# EAGLE design Pi-ic880a (EAGLE 8.4.0)
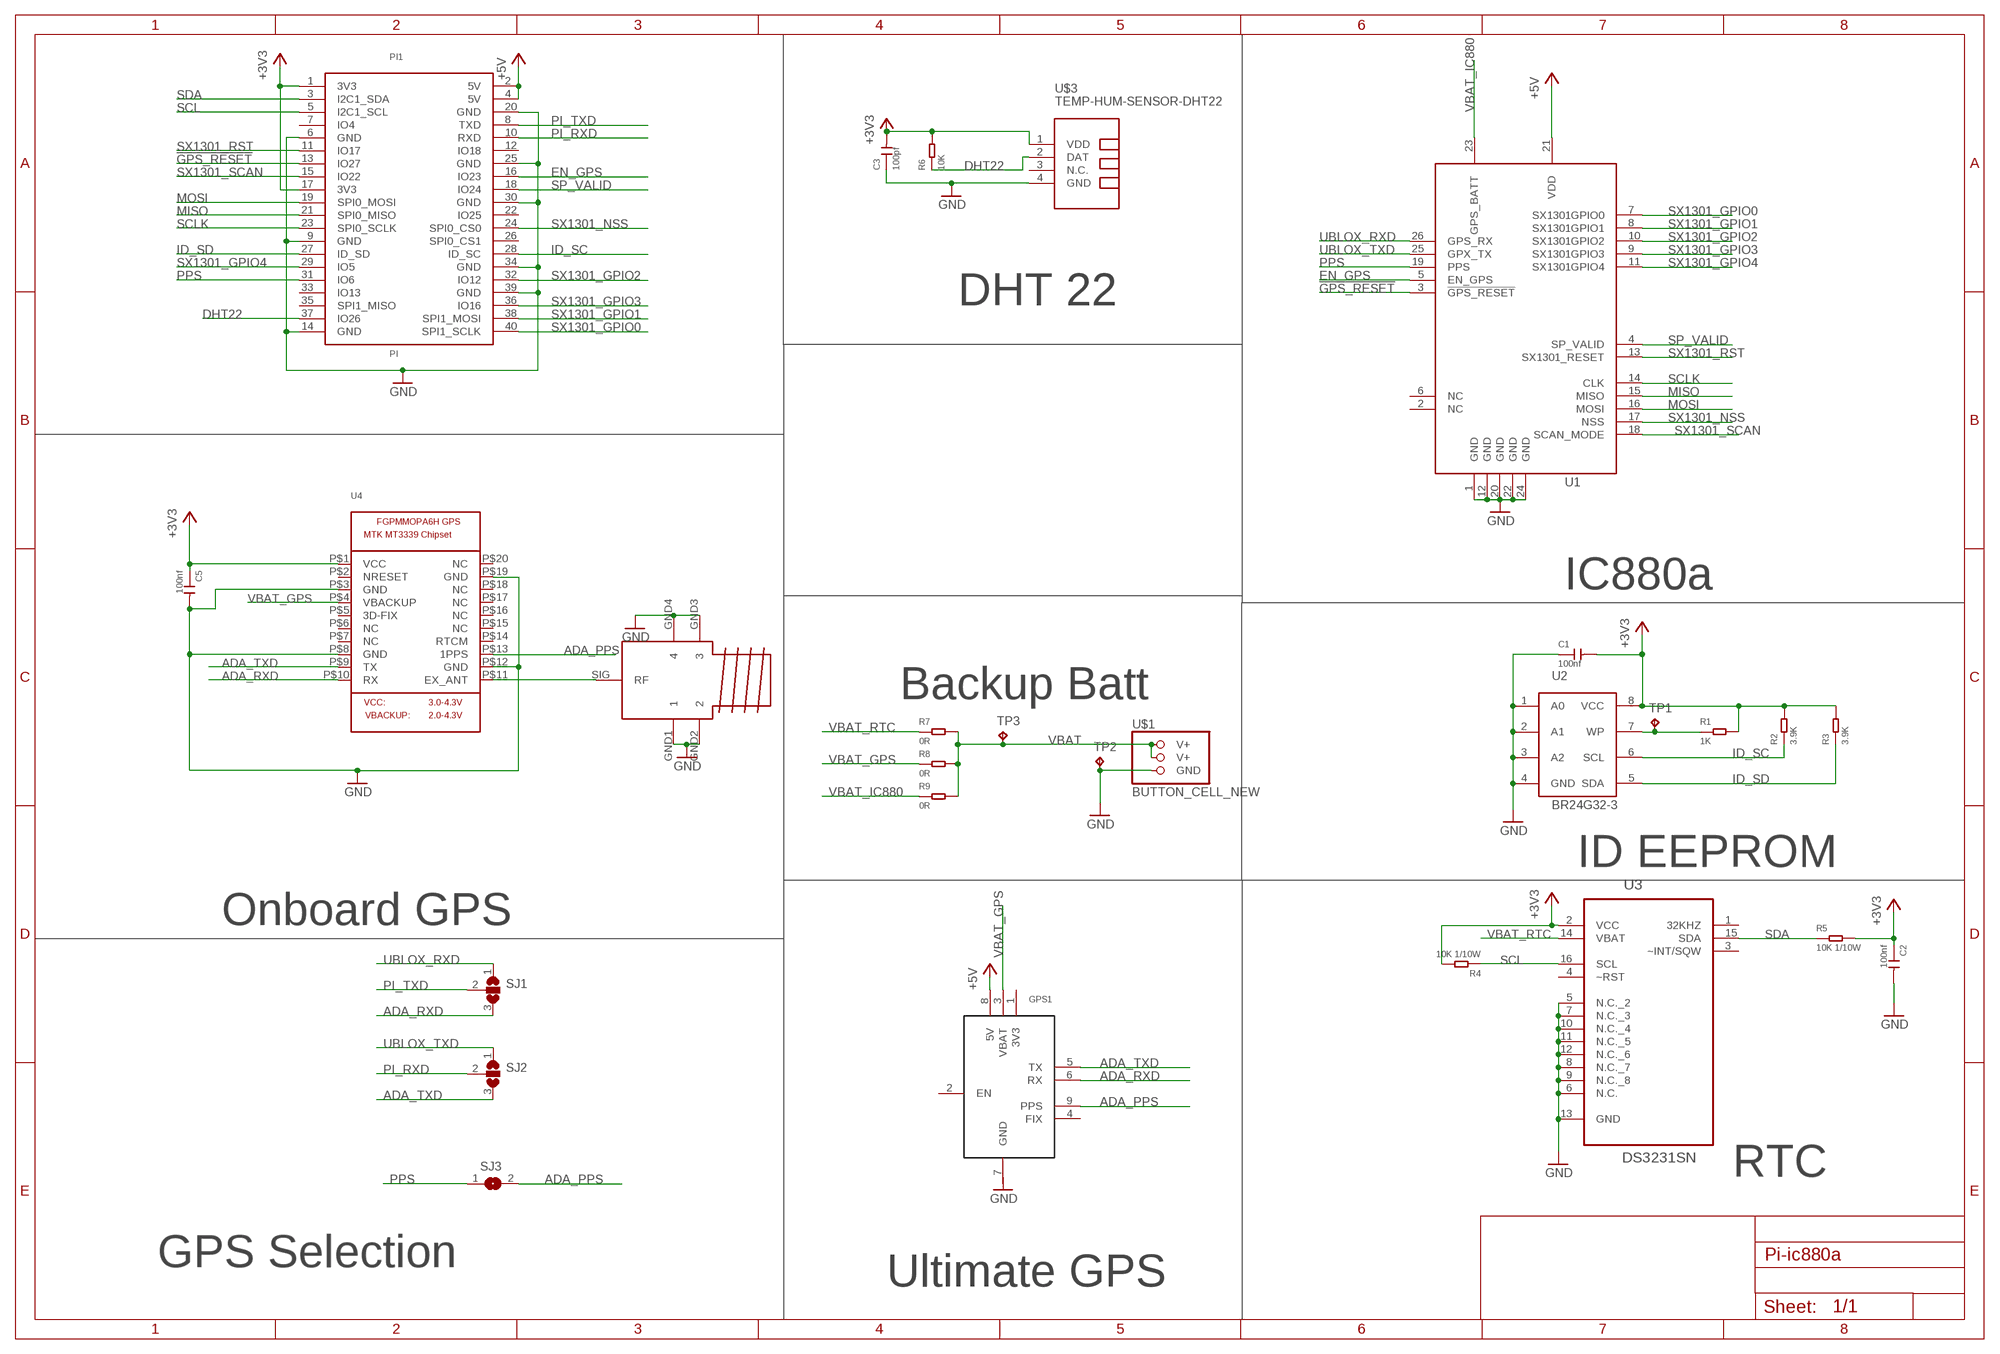
[diagram p0: schematic, sheet 1]

## Parts
C1  100nf  CERAMIC-100NF-50V-10%-X7R(0603)  [C0603]
C2  100nf  CERAMIC-100NF-50V-10%-X7R(0603)  [C0603]
C3  100pf  CERAMIC-100PF-50V-5%-NPO(0603)  [C0603]
C5  100nf  CERAMIC-100NF-50V-10%-X7R(0603)  [C0603]
GPS1  ULTIMATE-GPS  [ULTIMATE-GPS]
PI1  PI  [PI]
R1  1K  SMD-RES-1K-1%-1/10W(0603)  [R0603]
R2  3.9K  SMD-RES-3.9K-5%-1/10W(0603)  [R0603]
R3  3.9K  SMD-RES-3.9K-5%-1/10W(0603)  [R0603]
R4  10K 1/10W  SMD-RES-10K-5%-1/10W(0603)  [R0603]
R5  10K 1/10W  SMD-RES-10K-5%-1/10W(0603)  [R0603]
R6  10K  SMD-RES-10K-1%-1/10W(0603)  [R0603]
R7  0R  SMD-RES-0R-5%-1/10W(0603)  [R0603]
R8  0R  SMD-RES-0R-5%-1/10W(0603)  [R0603]
R9  0R  SMD-RES-0R-5%-1/10W(0603)  [R0603]
SJ1  SJ2W  [SJ_2]
SJ2  SJ2W  [SJ_2]
SJ3  SJ  [SJ]
TP1  TPB2,54  [B2,54]
TP2  TPB2,54  [B2,54]
TP3  TPB2,54  [B2,54]
U1  IC880A  [IC880A]
U2  BR24G32-3  [SOP8]
U3  DS3231SN  [SOIC127P1032X265-16N]
U4  GPS_FGPMMOPA6H  [FGPMMOPA6H]
U$1  BUTTON_CELL_NEW  [CR2016]
U$2  SMATH  [SMA]
U$3  TEMP-HUM-SENSOR-DHT22  [TEMP-HUM-SENSOR-DHT22]

## Nets
!GPS_RESET: PI1.13(IO27) U1.3(!GPS_RESET)
+3V3: C1.2 C2.1 C3.2 C5.1 PI1.1(3V3) PI1.17(3V3) R1.2 R2.2 R3.2 R4.2 R5.2 R6.2 U2.8(VCC) U3.2(VCC) U4.P$1(VCC) U$3.1(VDD)
+5V: GPS1.8(5V) PI1.2(5V) PI1.4(5V) U1.21(VDD)
ADA_PPS: GPS1.9(PPS) SJ3.2 U4.P$13(1PPS)
ADA_RXD: GPS1.6(RX) SJ1.3 U4.P$10(RX)
ADA_TXD: GPS1.5(TX) SJ2.3 U4.P$9(TX)
DHT22: PI1.37(IO26) R6.1 U$3.2(DAT)
EN_GPS: PI1.16(IO23) U1.5(EN_GPS)
GND: C1.1 C2.2 C3.1 C5.2 PI1.6(GND) PI1.9(GND) PI1.14(GND) PI1.20(GND) PI1.25(GND) PI1.30(GND) PI1.34(GND) PI1.39(GND) TP2.TP U1.1(GND) U1.12(GND) U1.20(GND) U1.22(GND) U1.24(GND) U2.1(A0) U2.2(A1) U2.3(A2) U2.4(GND) U3.5(N.C._2) U3.6(N.C.) U3.7(N.C._3) U3.8(N.C._7) U3.9(N.C._8) U3.10(N.C._4) U3.11(N.C._5) U3.12(N.C._6) U3.13(GND) U4.P$3(GND) U4.P$8(GND) U4.P$12(GND) U4.P$19(GND) U$1.GND U$2.GND1 U$2.GND2 U$2.GND3 U$2.GND4 U$3.4(GND)
GPS_ANT: U4.P$11(EX_ANT) U$2.SIG(RF)
ID_SC: PI1.28(ID_SC) R2.1 U2.6(SCL)
ID_SD: PI1.27(ID_SD) R3.1 U2.5(SDA)
MISO: PI1.21(SPI0_MISO) U1.15(MISO)
MOSI: PI1.19(SPI0_MOSI) U1.16(MOSI)
PI_RXD: PI1.10(RXD) SJ2.2
PI_TXD: PI1.8(TXD) SJ1.2
PPS: PI1.31(IO6) SJ3.1 U1.19(PPS)
SCL: PI1.5(I2C1_SCL) R4.1 U3.16(SCL)
SCLK: PI1.23(SPI0_SCLK) U1.14(CLK)
SDA: PI1.3(I2C1_SDA) R5.1 U3.15(SDA)
SP_VALID: PI1.18(IO24) U1.4(SP_VALID)
SX1301_GPIO0: PI1.40(SPI1_SCLK) U1.7(SX1301GPIO0)
SX1301_GPIO1: PI1.38(SPI1_MOSI) U1.8(SX1301GPIO1)
SX1301_GPIO2: PI1.32(IO12) U1.10(SX1301GPIO2)
SX1301_GPIO3: PI1.36(IO16) U1.9(SX1301GPIO3)
SX1301_GPIO4: PI1.29(IO5) U1.11(SX1301GPIO4)
SX1301_NSS: PI1.24(SPI0_CS0) U1.17(NSS)
SX1301_RST: PI1.11(IO17) U1.13(SX1301_RESET)
SX1301_SCAN: PI1.15(IO22) U1.18(SCAN_MODE)
UBLOX_RXD: SJ1.1 U1.26(GPS_RX)
UBLOX_TXD: SJ2.1 U1.25(GPX_TX)
VBAT: R7.2 R8.2 R9.2 TP3.TP U$1.V+@1(V+) U$1.V+@2(V+)
VBAT_GPS: GPS1.3(VBAT) R8.1 U4.P$4(VBACKUP)
VBAT_IC880: R9.1 U1.23(GPS_BATT)
VBAT_RTC: R7.1 U3.14(VBAT)
WP: R1.1 TP1.TP U2.7(WP)
Unconnected: GPS1.2(EN) GPS1.4(FIX) PI1.7(IO4) PI1.12(IO18) PI1.22(IO25) PI1.26(SPI0_CS1) PI1.33(IO13) PI1.35(SPI1_MISO) U1.2(NC) U1.6(NC) U3.1(32KHZ) U3.3(~INT/SQW) U3.4(~RST) U4.P$2(NRESET) U4.P$5(3D-FIX) U4.P$6(NC) U4.P$7(NC) U4.P$14(RTCM) U4.P$15(NC) U4.P$16(NC) U4.P$17(NC) U4.P$18(NC) U4.P$20(NC) U$3.3(N.C.)

## Notes on the sheet
- DHT 22
- IC880a
- Backup Batt
- ID EEPROM
- Onboard GPS
- RTC
- GPS Selection
- Ultimate GPS

## Power pins joined to a net without a drawn wire
3V3: GPS1.1(3V3)
GND: GPS1.7(GND)

## Library data of the parts
C1 C2 C5 = Seeed-Capacitor-2016:CERAMIC-100NF-50V-10%-X7R(0603): 302010138; MPN: CC0603KRX7R9BB104
C3 = Seeed-Capacitor:CERAMIC-100PF-50V-5%-NPO(0603): 302010076; MPN: CC0603JRNPO9BN101
GPS1 = fruit-parts:ULTIMATE-GPS
PI1 = fruit-parts:PI
R1 = Seeed-Resistor-2016:SMD-RES-1K-1%-1/10W(0603): 301010298; MPN: RC0603FR-071KL
R2 R3 = Seeed-Resistor-2016:SMD-RES-3.9K-5%-1/10W(0603): 301010101; MPN: RC0603JR-073K9L
R4 R5 = Seeed-Resistor-2016:SMD-RES-10K-5%-1/10W(0603): 301010293; MPN: RC0603JR-0710KL
R6 = Seeed-Resistor:SMD-RES-10K-1%-1/10W(0603): 301010299; MPN: RC0603FR-0710KL
R7-R9 = Seeed-Resistor:SMD-RES-0R-5%-1/10W(0603): 301010292; MPN: RC0603JR-070RL
SJ1 SJ2 = jumper:SJ2W: SMD solder JUMPER
SJ3 = jumper:SJ: SMD solder JUMPER
TP1-TP3 = testpad:TP: Test pad
U1 = fruit-parts:IC880A
U2 = farnell-parts:BR24G32-3: http://uk.farnell.com/rohm/br24g32fj-3gte2/serial-eeprom-32kbit-1mhz-sop/dp/2373743?MER=sy-me-pd-mi-alte
U3 = imported-parts:DS3231SN: Extremely Accurate I2C-Integrated RTC/TCXO/Crystal; MPN: DS3231SN#; OC_FARNELL: 1593292; OC_NEWARK: 68K3406; PACKAGE: SOIC-16; SUPPLIER: Maxim
U4 = fruit-parts:GPS_FGPMMOPA6H: GPS Module - MTK MT3339 Chipset, -165dBm sensitivity, 22 channels, 10Hz, auto-select external antenna options
U$1 = fruit-parts:BUTTON_CELL_NEW
U$2 = fruit-parts:SMA
U$3 = fruit-parts:TEMP-HUM-SENSOR-DHT22: DHT22 - digital humidity & temperature sensor Also known as: AM2302 AM2302 datasheet available here: http://akizukidenshi.com/download/ds/aosong/AM2302.pdf Click here to find device on ebay.com <http://www.ebay.com/sch/dht22+digital+sensor>

## Board
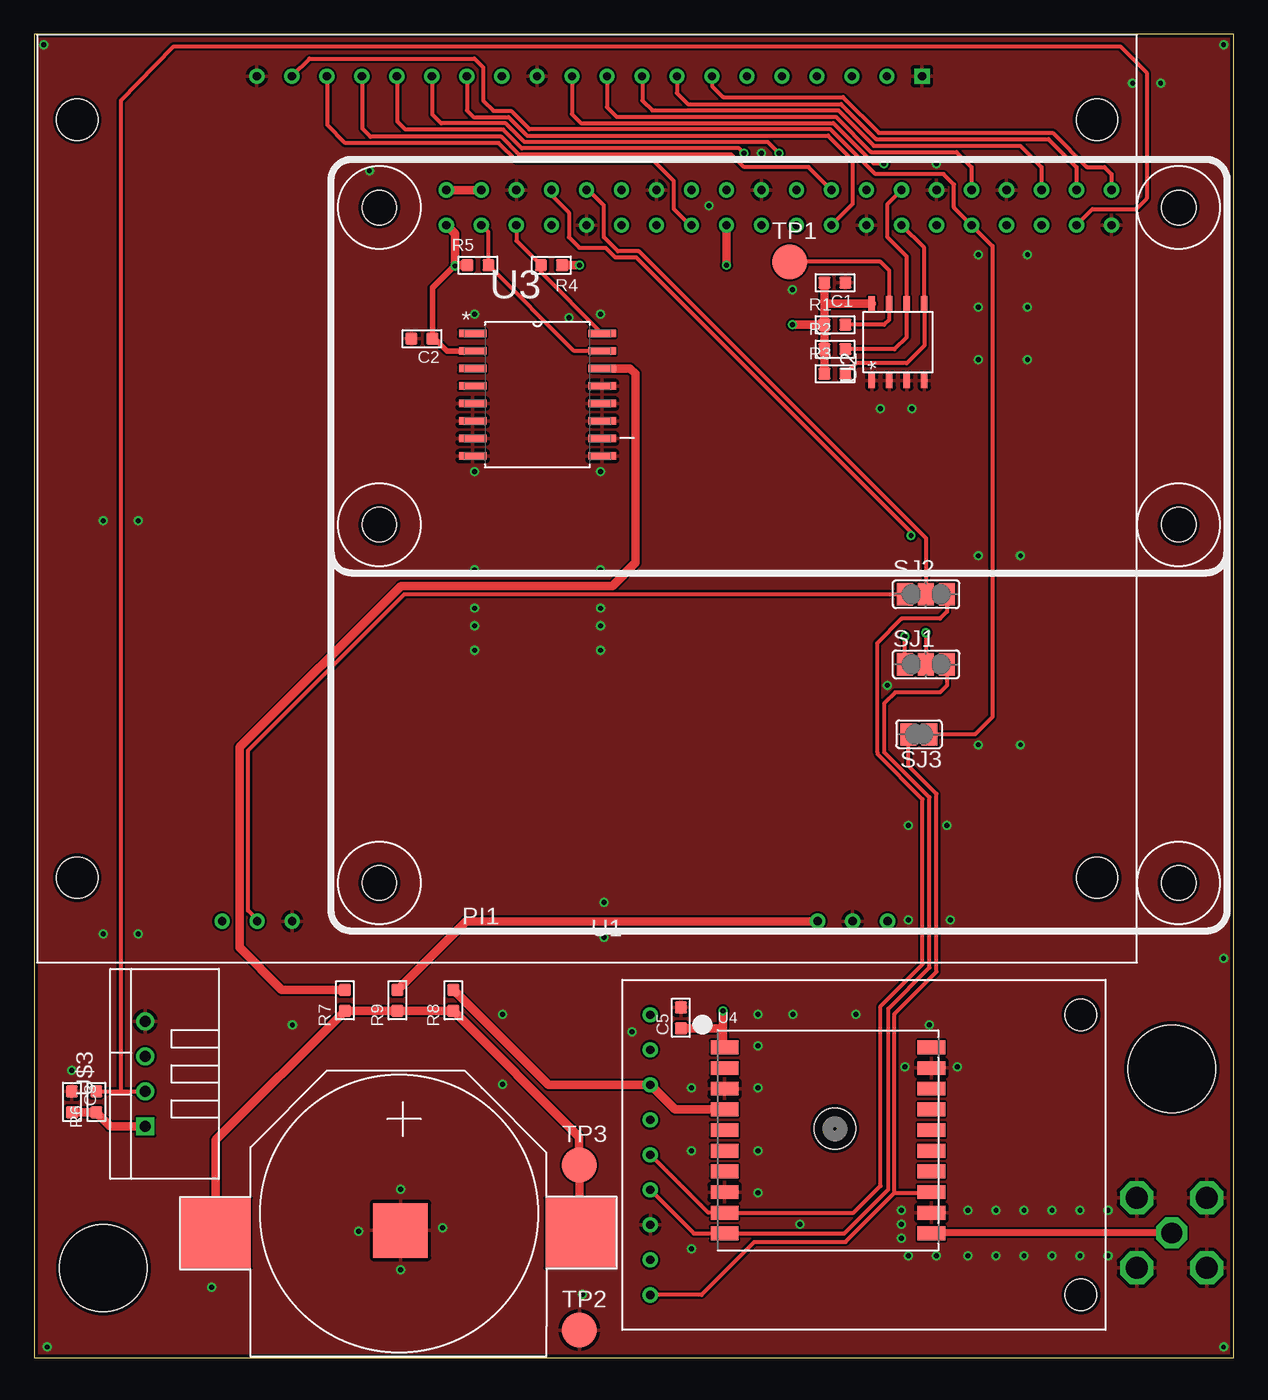
[diagram p1: board, top side]
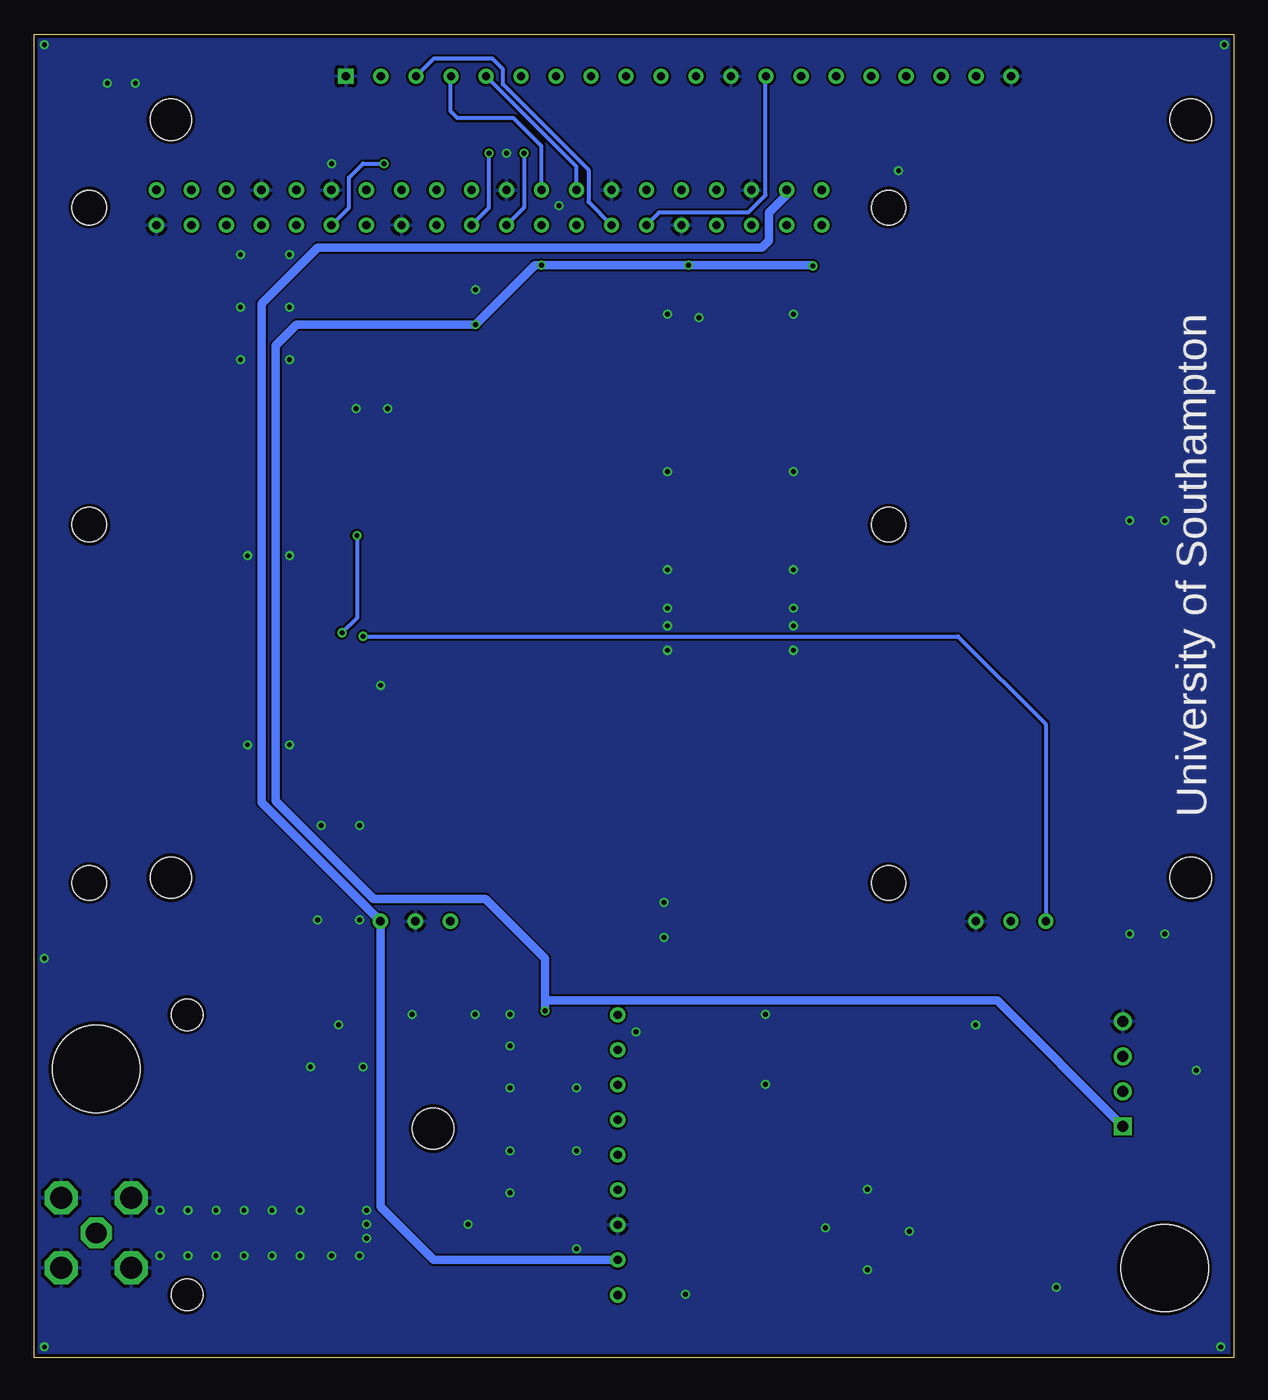
[diagram p2: board, bottom side, seen from below]

Size 87 x 96 mm. Coordinates in mm from the lower left corner, seen from the top.
Outline: 0,0 87,0 87,96 0,96 0,0
Copper layers (1*16): Top 0.035mm / dielectric 1.5mm / Bottom 0.035mm
Design rules "SeeedStudio_2layer_DRU_no_angle_20140221": minimum track width 6mil, minimum drill 12mil, track to track 6mil, track to pad 6mil, pad to pad 6mil, via to via 6mil, smd to smd 0mil, copper to edge 10mil, drill to drill 10mil, minimum pad ring 10mil, minimum via ring 6mil, stop-mask expansion 2mil, vias tented up to drill 100mil, thermal gap 10mil
Holes 6.35 mm at 82.52,20.95 5,6.5

### Footprints (pad centres in the part's own frame; a part is rotated, then mirrored left to right if it is on the bottom)
C0603 = smd 0.889 x 0.889: 1 0,0.762; 2 0,-0.762
ULTIMATE-GPS = drill 0.6: 1 -10.16,-15.494; 2 -7.62,-15.494; 3 -5.08,-15.494; 4 -2.54,-15.494; 5 0,-15.494; 6 2.54,-15.494; 7 5.08,-15.494; 8 7.62,-15.494; 9 10.16,-15.494 | hole 2.286: -10.16,15.748; 10.16,15.748
PI = drill 0.6: 1 -24.13,23.23; 2 -24.13,25.77; 3 -21.59,23.23; 4 -21.59,25.77; 5 -19.05,23.23; 6 -19.05,25.77; 7 -16.51,23.23; 8 -16.51,25.77; 9 -13.97,23.23; 10 -13.97,25.77; 11 -11.43,23.23; 12 -11.43,25.77; 13 -8.89,23.23; 14 -8.89,25.77; 15 -6.35,23.23; 16 -6.35,25.77; 17 -3.81,23.23; 18 -3.81,25.77; 19 -1.27,23.23; 20 -1.27,25.77; 21 1.27,23.23; 22 1.27,25.77; 23 3.81,23.23; 24 3.81,25.77; 25 6.35,23.23; 26 6.35,25.77; 27 8.89,23.23; 28 8.89,25.77; 29 11.43,23.23; 30 11.43,25.77; 31 13.97,23.23; 32 13.97,25.77; 33 16.51,23.23; 34 16.51,25.77; 35 19.05,23.23; 36 19.05,25.77; 37 21.59,23.23; 38 21.59,25.77; 39 24.13,23.23; 40 24.13,25.77 | hole 2.5: -29,24.5; 29,24.5; -29,1.5; 29,1.5; -29,-24.5; 29,-24.5
R0603 = smd 0.889 x 0.889: 1 0,0.762; 2 0,-0.762
SJ_2 = smd 1.168 x 1.6: 1 -1.524,0; 2 0,0; 3 1.524,0
SJ = smd 1.168 x 1.6: 1 -0.762,0; 2 0.762,0
B2,54 = smd 2.54 x 2.54: TP 0,0
IC880A = drill 0.6 square: 1 -24.3,-30.65 | drill 0.6: 2 -21.76,-30.65; 3 -19.22,-30.65; 4 -16.68,-30.65; 5 -14.14,-30.65; 6 -11.6,-30.65; 7 -9.06,-30.65; 8 -6.52,-30.65; 9 -3.98,-30.65; 10 -1.44,-30.65; 11 1.1,-30.65; 12 3.64,-30.65; 13 6.18,-30.65; 14 8.72,-30.65; 15 11.26,-30.65; 16 13.8,-30.65; 17 16.34,-30.65; 18 18.88,-30.65; 19 21.42,-30.65; 20 23.96,-30.65; 21 -21.8,30.65; 22 -19.26,30.65; 23 -16.72,30.65; 24 21.4,30.65; 25 23.94,30.65; 26 26.48,30.65 | hole 3: -37,27.5; 37,27.5; -37,-27.5; 37,-27.5
SOP8 = smd 1 x 0.5: 1 -2.8,1.905; 2 -2.8,0.635; 3 -2.8,-0.635; 4 -2.8,-1.905; 5 2.8,-1.905; 6 2.8,-0.635; 7 2.8,0.635; 8 2.8,1.905
SOIC127P1032X265-16N = smd 1.981 x 0.533: 1 -4.699,4.445; 2 -4.699,3.175; 3 -4.699,1.905; 4 -4.699,0.635; 5 -4.699,-0.635; 6 -4.699,-1.905; 7 -4.699,-3.175; 8 -4.699,-4.445; 9 4.699,-4.445; 10 4.699,-3.175; 11 4.699,-1.905; 12 4.699,-0.635; 13 4.699,0.635; 14 4.699,1.905; 15 4.699,3.175; 16 4.699,4.445
FGPMMOPA6H = smd 2 x 1: P$1 -7.5,6.75; P$2 -7.5,5.25; P$3 -7.5,3.75; P$4 -7.5,2.25; P$5 -7.5,0.75; P$6 -7.5,-0.75; P$7 -7.5,-2.25; P$8 -7.5,-3.75; P$9 -7.5,-5.25; P$10 -7.5,-6.75; P$11 7.5,-6.75; P$12 7.5,-5.25; P$13 7.5,-3.75; P$14 7.5,-2.25; P$15 7.5,-0.75; P$16 7.5,0.75; P$17 7.5,2.25; P$18 7.5,3.75; P$19 7.5,5.25; P$20 7.5,6.75 | hole 3: 0.5,0.85
CR2016 = smd 3.962 x 3.962: GND -1.7,8.63 | smd 5.08 x 5.08: V+@1 -14.765,8.812; V+@2 11.7,8.83
SMA = drill 1.6 octagon: GND1 -2.54,2.54; GND2 2.54,2.54; GND3 2.54,-2.54; GND4 -2.54,-2.54 | drill 1.5 octagon: SIG 0,0
TEMP-HUM-SENSOR-DHT22 = drill 0.8 square: 1 -3.81,0 | drill 0.8: 2 -1.27,0; 3 1.27,0; 4 3.81,0

### Placement (x,y rotation side)
C1  58.08,77.99 270 top
C2  28.11,73.93 270 top
C3  2.71,18.55 0 top
C5  46.91,24.65 180 top
GPS1  60.18,14.71 270 top
PI1  54.02,58.94 0 top
R1  58.08,74.94 270 top
R2  58.08,73.16 270 top
R3  58.08,71.39 270 top
R4  37.51,79.26 90 top
R5  32.18,79.26 270 top
R6  4.49,18.55 0 top
R7  22.52,25.92 0 top
R8  30.4,25.92 0 top
R9  26.33,25.92 0 top
SJ1  64.69,50.3 0 top
SJ2  64.69,55.38 0 top
SJ3  64.18,45.22 180 top
TP1  54.78,79.51 0 top
TP2  39.54,2 0 top
TP3  39.54,13.98 0 top
U1  40.1,62.31 180 top
U2  62.66,73.67 90 top
U3  36.49,69.86 0 top
U4  57.58,15.76 0 top
U$1  24.85,17.86 180 top
U$2  82.52,9.05 0 top
U$3  8.05,20.59 90 top

### Tracks (layer width: path | path; a pad name or v marks a point on that pad's centre or on a via)
!GPS_RESET
  Bottom 0.305: U1.3 58.04,94.25 53.77,94.25 53,93.48 53,92.38 46.81,86.18 46.81,83.85 PI1.13
+3V3  (via drill 0.35)
  Top 0.406: 28.87,74.11 C2.1 | 28.87,74.11 28.87,77.61 30.52,79.26 | U3.2 29.95,73.04 28.87,74.11
  Top 0.61: PI1.1 30.52,81.53 30.52,79.26 v30.52,79.21 30.58,79.26 R5.2 | R1.2 R2.2 R3.2 | R1.2 v55,74.94 | C3.2 R6.2 5.51,16.78 U$3.1 | R4.2 v39.54,79.26 | 57.32,76.47 R1.2 | 57.32,76.47 C1.2 | U2.8 57.33,76.47 57.32,76.47 | PI1.17 v50.21,79.26 | 49.96,23.89 C5.1 | v49.96,25.16 49.96,23.89 | U4.P$1 49.96,22.63 49.96,23.89
  Bottom 0.61: v30.52,79.21 30.58,79.26 v39.54,79.26 v50.21,79.26 50.68,79.26 v55,74.94 67.99,74.94 69.51,73.42 69.51,40.4 62.4,33.29 54.27,33.29 49.96,28.97 49.96,25.92 | 49.96,25.92 v49.96,25.16 | U$3.1 17.15,25.92 49.96,25.92
+5V
  Top 0.61: PI1.2 PI1.4
  Bottom 0.61: GPS1.8 58.05,7.09 61.9,10.94 U1.21 70.53,40.3 70.53,76.47 66.47,80.53 34.21,80.53 33.7,81.04 33.7,83.07 32.43,84.34 PI1.4
ADA_PPS
  Top 0.305: 64.24,12.01 U4.P$13 65.02,11.95 62.4,11.95 | 62.4,11.95 58.85,8.39 52.24,8.39 48.4,4.55 GPS1.9 | 62.4,11.95 62.4,24.94 65.45,27.98 65.45,40.91 63.42,42.94 SJ3.2
ADA_RXD
  Top 0.305: SJ1.3 66.21,48.78 65.7,48.27 62.45,48.27 61.64,47.46 61.64,43.95 64.94,40.65 64.94,28.3 61.95,25.31 61.95,12.2 58.75,9.01 U4.P$10 47.85,9.01 GPS1.6
ADA_TXD
  Top 0.305: 49.36,10.51 U4.P$9 | SJ2.3 66.21,54.11 65.7,53.61 62.91,53.61 61.13,51.83 61.13,43.95 61.18,43.9 61.18,43.77 64.43,40.51 64.43,28.55 61.39,25.5 61.39,12.46 59.44,10.51 U4.P$9 | U4.P$9 48.89,10.51 GPS1.5
DHT22
  Top 0.305: 6.27,19.32 6.27,91.2 10.1,95.14 78.78,95.14 80.69,93.23 80.69,84.09 79.93,83.32 76.76,83.32 PI1.37 | R6.1 6.27,19.32 | 6.27,19.32 U$3.2
EN_GPS
  Bottom 0.305: PI1.16 47.67,86.4 U1.5
GND  (via drill 0.35)
  other vias: 55.54,9.66 67.74,10.68 69.77,10.68 71.8,10.68 73.83,10.68 75.86,10.68 67.74,7.38 69.77,7.38 71.8,7.38 73.83,7.38 75.86,7.38 52.5,22.62 47.67,19.57 47.67,15 52.5,15 47.67,7.89 62.91,10.68 65.45,7.38 63.42,7.38 64.94,24.14 66.97,21.09 63.16,21.09 59.61,24.9 55.04,24.9 52.5,24.9 23.52,9.16 29.61,9.41 26.56,12.2 26.56,6.36 0.68,95.26 86.28,95.26 86.28,28.97 55,77.48 61.89,48.78 52.75,87.39 31.92,64.27 41.07,64.27 61.39,68.85 63.67,68.85 39.77,4.58 12.85,5.09 31.92,75.7 38.78,75.45 41.07,75.7 5,60.72 7.54,60.72 5,30.75 7.54,30.75 2.71,20.84 86.28,0.77 0.93,0.77 24.3,86.12 41.07,57.16 41.07,54.37 41.07,51.32 41.07,53.1 31.92,57.16 31.92,54.37 31.92,53.1 31.92,51.32 41.32,33.03 41.32,30.49 18.71,24.14 33.95,24.9 43.35,23.63 33.95,19.82 52.5,19.57 52.5,11.95 62.91,8.65 62.91,9.66 77.9,10.68 77.9,7.38 63.42,31.76 63.42,38.62 66.47,31.76 66.21,38.62 68.5,44.46 71.55,44.46 68.5,58.18 71.55,58.18 68.5,76.21 72.05,76.21 68.5,72.4 72.05,72.4 68.5,80.02 72.05,80.02 79.67,92.47 81.71,92.47 65.45,86.63 48.94,83.58
  pour Bottom: -4.15,102.12 91.1,102.12 91.1,-4.81 -3.89,-4.81 -3.89,101.61
  pour Top: -3.13,99.07 89.07,99.07 89.07,-1.51 -3.13,-1.51
GPS_ANT
  Top 0.508: U$2.SIG 65.11,9.05 U4.P$11
ID_SC
  Top 0.305: R2.1 62.4,73.16 63.29,74.05 U2.6 63.29,79.9 61.89,81.29 61.89,83.69 PI1.28
ID_SD
  Top 0.305: PI1.27 64.56,80.52 U2.5 64.56,73.42 63.29,72.15 59.61,72.15 R3.1
MISO  (via drill 0.35)
  Top 0.305: U1.15 28.87,92.93 28.87,90.18 29.51,89.55 34.2,89.55 35.54,88.2 53.21,88.2 v54.02,87.39
  Bottom 0.305: v54.02,87.39 54.02,83.44 PI1.21
MOSI  (via drill 0.35)
  Top 0.305: v51.48,87.39 51.12,87.74 35.35,87.74 34.01,89.09 26.92,89.09 26.33,89.67 26.33,92.93 U1.16
  Bottom 0.305: v51.48,87.39 51.48,83.44 PI1.19
PI_RXD
  Top 0.305: PI1.10 40.19,84.71 41.32,83.58 41.32,81.29 42.34,80.28 43.86,80.28 64.69,59.45 SJ2.2
PI_TXD  (via drill 0.35)
  Top 0.305: PI1.8 37.51,84.34 38.78,83.07 38.78,81.29 39.54,80.53 41.44,80.53 42.15,79.82 43.67,79.82 63.61,59.88 v63.61,59.64 63.61,59.73 | v64.69,52.59 SJ1.2
  Bottom 0.305: v63.61,59.64 63.61,53.67 v64.69,52.59
PPS
  Top 0.305: U1.19 19.96,94.25 31.92,94.25 32.56,93.61 32.56,91.2 33.29,90.46 34.58,90.46 35.92,89.12 57.77,89.12 61.02,85.86 65.96,85.86 66.72,85.1 66.72,83.44 PI1.31 69.51,80.65 69.51,46.49 68.24,45.22 SJ3.1
SCL
  Top 0.305: PI1.5 34.97,81.04 R4.1 36.75,78.75 U3.16
SCLK
  Top 0.305: U1.14 31.38,90.47 31.85,90 34.39,90 35.73,88.66 57.58,88.66 59.35,86.88 59.35,83.69 PI1.23
SDA
  Top 0.305: PI1.3 32.94,81.66 R5.1 39.16,73.04 U3.15
SP_VALID
  Bottom 0.305: PI1.18 50.21,87.9 52.24,89.93 56.31,89.93 56.81,90.44 56.81,92.93 U1.4
SX1301_GPIO0
  Top 0.305: U1.7 49.16,92.25 49.96,91.45 58.66,91.45 61.25,88.86 73.88,88.86 76.37,86.37 77.64,86.37 78.15,85.86 PI1.40
SX1301_GPIO1
  Top 0.305: U1.8 46.62,91.74 47.42,90.94 58.52,90.94 61.06,88.4 73.58,88.4 75.61,86.37 PI1.38
SX1301_GPIO2
  Top 0.305: U1.10 41.54,90.73 42.23,90.03 58.14,90.03 60.7,87.47 66.89,87.47 67.99,86.37 PI1.32
SX1301_GPIO3
  Top 0.305: U1.9 44.11,92.93 44.11,91.2 44.83,90.49 58.33,90.49 60.89,87.93 71.52,87.93 73.07,86.37 PI1.36
SX1301_GPIO4  (via drill 0.35)
  Top 0.305: U1.11 39,90.22 39.64,89.57 57.95,89.57 60.89,86.64 61.63,86.64 v61.64,86.63
  Bottom 0.305: PI1.29 64.18,83.44 64.18,85.61 63.16,86.63 v61.64,86.63
SX1301_NSS
  Top 0.305: PI1.24 56.17,86.37 51.48,86.37 50.57,87.29 35.16,87.29 33.87,88.58 24.38,88.58 23.79,89.17 23.79,92.93 U1.17
SX1301_RST
  Bottom 0.305: U1.13 33.95,92.93 33.95,84.34 35.22,83.07 41.69,83.07 PI1.11
SX1301_SCAN
  Top 0.305: PI1.15 47.55,82.17 46.4,83.32 46.4,85.36 44.93,86.83 35.35,86.83 | 35.35,86.83 | 35.35,86.83 34.97,86.83 33.68,88.12 22.55,88.12 21.25,89.42 21.25,92.93 U1.18
UBLOX_RXD  (via drill 0.35)
  Top 0.305: SJ1.1 v63.16,52.34
  Bottom 0.305: U1.26 13.62,45.97 19.98,52.34 v63.16,52.34
UBLOX_TXD
  Top 0.305: SJ2.1 26.84,55.38 15.49,44.03 15.49,32.44 16.16,31.78 U1.25
VBAT
  Top 0.61: U$1.V+@1 39.52,9.15 39.54,9.15 TP3.TP 39.52,13.98 39.52,16.03 R8.2 R9.2 R7.2 13.15,15.79 U$1.V+@2
VBAT_GPS
  Top 0.61: U4.P$4 46.47,18.01 GPS1.3 37.29,19.79 R8.1
VBAT_IC880
  Top 0.61: R9.1 31.32,31.66 U1.23
VBAT_RTC
  Top 0.61: U3.14 43.23,71.77 43.61,71.39 43.61,57.67 41.93,55.99 26.59,55.99 14.88,44.29 14.88,29.75 | 14.88,29.75 14.9,29.73 | R7.1 17.95,26.68 14.88,29.75
WP
  Top 0.305: R1.1 61.64,74.94 62.02,75.32 U2.7 62.02,78.88 61.39,79.51 TP1.TP

### Text on the board
top_silk: Adafruit Ultimate GPS
bottom_silk: University of Southampton
silktop: EEPROM WP | TX | UBlox | Seperate | RX | UBlox | Seperate | PPS Link | RTC | UBX | GPS | Backup Batt | V1.0